# Altium schematic sheet top_schematic.SchDoc: TOP
size A3; DocumentNumber: 1; SheetNumber: 1; SheetTotal: 19
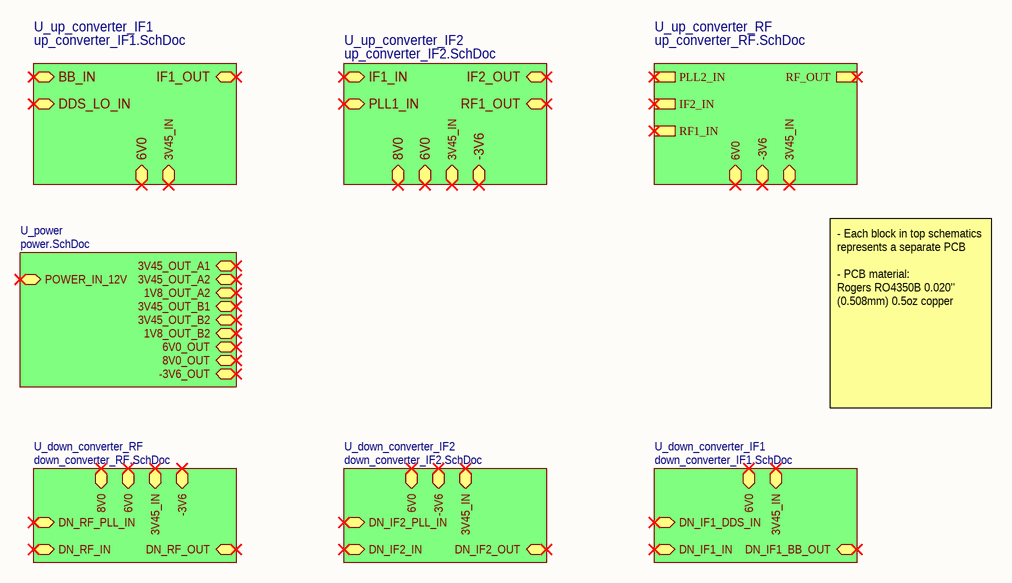
[diagram p0: top_schematic.SchDoc]

## Sub-sheets
U_down_converter_IF1 = down_converter_IF1.SchDoc: 3V45_IN, DN_IF1_IN, DN_IF1_DDS_IN, 6V0, DN_IF1_BB_OUT
U_down_converter_IF2 = down_converter_IF2.SchDoc: 6V0, DN_IF2_OUT, DN_IF2_PLL_IN, -3V6, DN_IF2_IN, 3V45_IN
U_down_converter_RF = down_converter_RF.SchDoc: DN_RF_IN, -3V6, DN_RF_PLL_IN, 8V0, 6V0, 3V45_IN, DN_RF_OUT
U_power = power.SchDoc: POWER_IN_12V, -3V6_OUT, 6V0_OUT, 8V0_OUT, 3V45_OUT_A2, 3V45_OUT_B1, 1V8_OUT_B2, 3V45_OUT_B2, 3V45_OUT_A1, 1V8_OUT_A2
U_up_converter_IF1 = up_converter_IF1.SchDoc: BB_IN, IF1_OUT, DDS_LO_IN, 6V0, 3V45_IN
U_up_converter_IF2 = up_converter_IF2.SchDoc: 8V0, PLL1_IN, IF1_IN, 6V0, RF1_OUT, IF2_OUT, -3V6, 3V45_IN
U_up_converter_RF = up_converter_RF.SchDoc: PLL2_IN, IF2_IN, RF1_IN, RF_OUT, 6V0, -3V6, 3V45_IN

## Notes on the sheet
- - Each block in top schematics represents a separate PCB
  - PCB material:
  Rogers RO4350B 0.020'' (0.508mm) 0.5oz copper